# EasyEDA Pro project 数控电源_V3.eprj, schematic Schematic3
Board Name: 输出指示灯; Create Date: 2025-09-15; Page Name: P1; Project Name: 数控电源_V3; Schematic Name: Schematic3; Update Date: 2025-09-15; Company: 嘉立创EDA; Page Size: A4; Version: V3
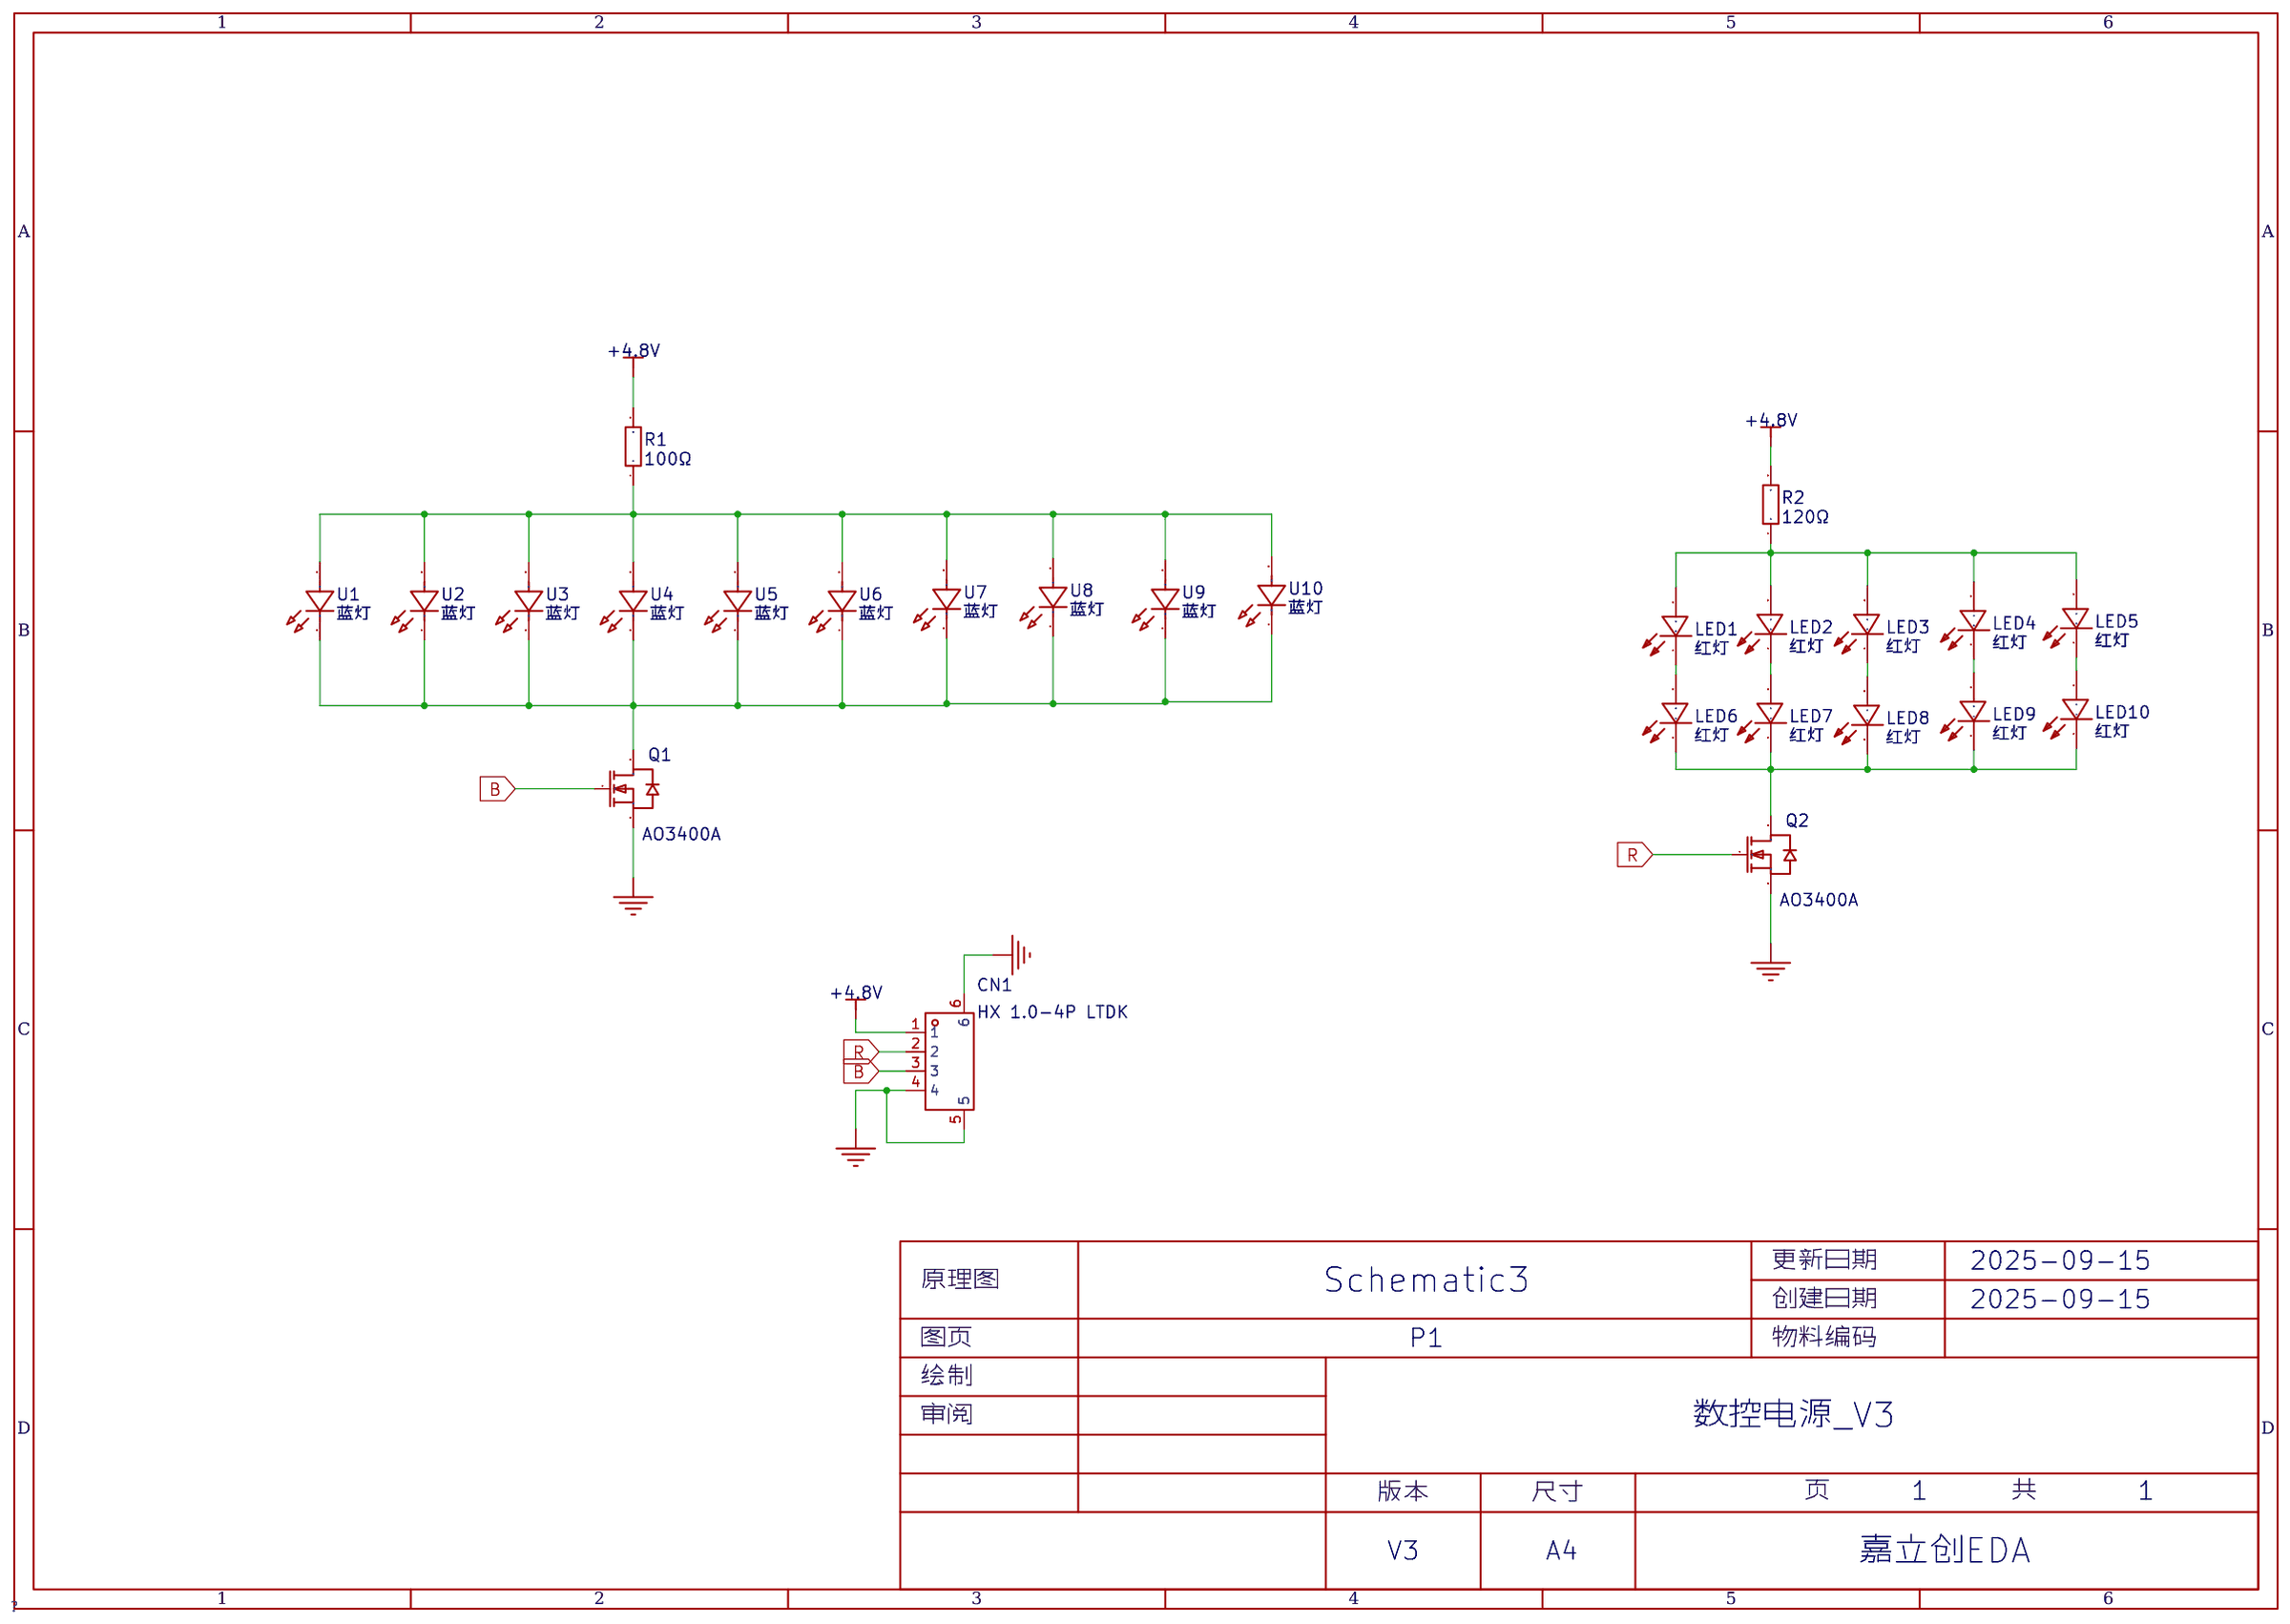
[diagram p0: schematic sheet]

## Parts
CN1  HX 1.0-4P LTDK  [CONN-SMD_4P-P1.00_HX-1.0-4P-LTDK-1]
LED1  红灯  [LED0402-RD]
LED2  红灯  [LED0402-RD]
LED3  红灯  [LED0402-RD]
LED4  红灯  [LED0402-RD]
LED5  红灯  [LED0402-RD]
LED6  红灯  [LED0402-RD]
LED7  红灯  [LED0402-RD]
LED8  红灯  [LED0402-RD]
LED9  红灯  [LED0402-RD]
LED10  红灯  [LED0402-RD]
Q1  AO3400A  [SOT-23-3_L2.9-W1.3-P1.90-LS2.4-BR]
Q2  AO3400A  [SOT-23-3_L2.9-W1.3-P1.90-LS2.4-BR]
R1  100Ω  [R0603]
R2  120Ω  [R0603]
U1  蓝灯  [LED0402-RD]
U2  蓝灯  [LED0402-RD]
U3  蓝灯  [LED0402-RD]
U4  蓝灯  [LED0402-RD]
U5  蓝灯  [LED0402-RD]
U6  蓝灯  [LED0402-RD]
U7  蓝灯  [LED0402-RD]
U8  蓝灯  [LED0402-RD]
U9  蓝灯  [LED0402-RD]
U10  蓝灯  [LED0402-RD]

## Library data of the parts
CN1 = HX 1.0-4P LTDK: 插针结构:1x4P;间距:1mm;安装方式:立贴;参考系列:-;总PIN数:4P;排数:1;每排PIN数:4;行距:-;额定电流:1A;触头材质:-;触头镀层:-;工作温度范围:-25℃~+85℃;; LCSC Part Name: 1x4P 间距:1mm 立贴; Supplier Part: C41418907; Manufacturer: hanxia(韩下); Supplier Footprint: SMD,P=1mm; JLCPCB Part Class: 扩展库; Datasheet: https://atta.szlcsc.com/upload/public/pdf/source/20240929/8B899CFD16D7C20C7E18994B45295F13.pdf; Supplier: LCSC; Pins Structure: 1x4P; Pitch: 1mm; Mounting Style: 立贴; Number of Pins: 4P; Number of Rows: 1; Number of PINs Per Row: 4; Current Rating (Max): 1A; Operating Temperature Range: -25℃~+85℃; Colour: 米色
LED1-LED10 = NCD0402R1: 发光颜色:红色;正向电压(VF):1.6V~2.6V;功率:65mW;正向电流:5mA;主波长:615nm~635nm;透镜颜色:无色透明透镜;发光强度:13mcd~30mcd;发光角度:130°;工作温度:-30℃~+85℃;; Supplier Part: C130719; Manufacturer: 国星光电; Supplier Footprint: 0402; JLCPCB Part Class: 扩展库; Datasheet: https://atta.szlcsc.com/upload/public/pdf/source/20200820/C130719_A72EA5A7FEC83C35856EA0453E4EE775.pdf; Supplier: LCSC; Emitted Color: 红色; Forward Voltage (VF): 1.6V~2.6V; Power Dissipation: 65mW; Forward Current: 5mA; Dominant Wavelength: 615nm~635nm; Lens Color: 无色透明透镜; Luminous Intensity: 13mcd~30mcd; Viewing Angle: 130°; Operating Temperature: -30℃~+85℃
Q1 Q2 = AO3400A_C347475: Supplier Part: C347475; Manufacturer: UMW(友台半导体); Supplier Footprint: SOT-23; JLCPCB Part Class: Extended Part; Datasheet: https://atta.szlcsc.com/upload/public/pdf/source/20190827/C347475_40CAF14D9CD0153436F5DC917B39143D.pdf; Supplier: LCSC
R1 = RC0603FR-07100RL: 电阻类型:厚膜电阻;阻值:100Ω;精度:±1%;功率:100mW;; LCSC Part Name: 100Ω ±1% 100mW; Supplier Part: C105588; Manufacturer: YAGEO(国巨); Supplier Footprint: 0603; JLCPCB Part Class: 扩展库; Datasheet: https://atta.szlcsc.com/upload/public/pdf/source/20170428/1493376742308.pdf; Supplier: LCSC; Type: 厚膜电阻; Tolerance: ±1%; Power(Watts): 100mW; Temperature Coefficient: ±100ppm/℃; Overload Voltage (Max): 75V; Operating Temperature Range: -55℃~+155℃
R2 = 0603WAF1200T5E: 电阻类型:厚膜电阻;阻值:120Ω;精度:±1%;功率:100mW;最大工作电压:75V;温度系数:±100ppm/℃;; LCSC Part Name: 120Ω ±1% 100mW 厚膜电阻; Supplier Part: C22787; Manufacturer: UNI-ROYAL(厚声); Supplier Footprint: 0603; JLCPCB Part Class: 基础库; Datasheet: https://atta.szlcsc.com/upload/public/pdf/source/20200306/C422600_1E6D84923E4A46A82E41ADD87F860B5C.pdf; Supplier: LCSC; Type: 厚膜电阻; Tolerance: ±1%; Power(Watts): 100mW; Overload Voltage (Max): 75V; Temperature Coefficient: ±100ppm/℃; Operating Temperature Range: -55℃~+155℃
U1-U10 = XL-1005UBC_C22355736: LCSC Part Name: XL-1005UBC; Supplier Part: C22355736; Manufacturer: XINGLIGHT(成兴光); Supplier Footprint: 0402; JLCPCB Part Class: 扩展库; Datasheet: https://atta.szlcsc.com/upload/public/pdf/source/20240218/22840B7D9C9A825BCFA041B254C415EC.pdf; Supplier: LCSC

## Nets
+4.8V: CN1.1 R1.2 R2.2
GND: CN1.4 CN1.5 CN1.6 Q1.2(S) Q2.2(S)
B: CN1.3 Q1.1(G)
R: CN1.2 Q2.1(G)
$1N545: Q1.3(D) U1.1(K) U2.1(K) U3.1(K) U4.1(K) U5.1(K) U6.1(K) U7.1(K) U8.1(K) U9.1(K) U10.1(K)
$1N614: R1.1 U1.2(A) U2.2(A) U3.2(A) U4.2(A) U5.2(A) U6.2(A) U7.2(A) U8.2(A) U9.2(A) U10.2(A)
$1N742: LED6.1(K) LED7.1(K) LED8.1(K) LED9.1(K) LED10.1(K) Q2.3(D)
$1N932: LED1.1(K) LED6.2(A)
$1N935: LED2.1(K) LED7.2(A)
$1N941: LED3.1(K) LED8.2(A)
$1N948: LED1.2(A) LED2.2(A) LED3.2(A) LED4.2(A) LED5.2(A) R2.1
$1N1992: LED4.1(K) LED9.2(A)
$1N2073: LED5.1(K) LED10.2(A)
